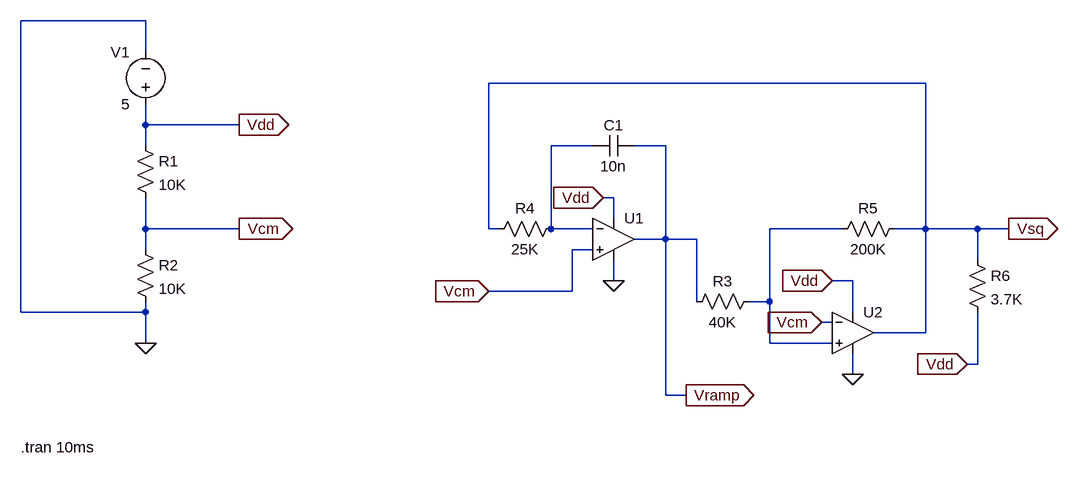
[diagram p0: schematic RAMP GENERATOR.asc]
RAMP GENERATOR.asc, the LTspice schematic file:
Version 4.1
SHEET 1 884 680
WIRE -544 -128 -736 -128
WIRE -544 -80 -544 -128
WIRE 656 -32 -16 -32
WIRE -544 32 -544 0
WIRE -400 32 -544 32
WIRE -544 64 -544 32
WIRE 144 64 80 64
WIRE 256 64 208 64
WIRE 176 144 160 144
WIRE 176 176 176 144
WIRE -544 192 -544 144
WIRE -400 192 -544 192
WIRE -16 192 -16 -32
WIRE 0 192 -16 192
WIRE 80 192 80 64
WIRE 144 192 80 192
WIRE 528 192 416 192
WIRE 656 192 656 -32
WIRE 656 192 608 192
WIRE 736 192 656 192
WIRE 784 192 736 192
WIRE 256 208 256 64
WIRE 256 208 208 208
WIRE 304 208 256 208
WIRE -544 224 -544 192
WIRE 144 224 112 224
WIRE 736 240 736 192
WIRE 176 272 176 240
WIRE 544 272 512 272
WIRE 112 288 112 224
WIRE 112 288 -16 288
WIRE 304 304 304 208
WIRE 416 304 416 192
WIRE 416 304 384 304
WIRE -736 320 -736 -128
WIRE -544 320 -544 304
WIRE -544 320 -736 320
WIRE 544 320 544 272
WIRE 512 336 496 336
WIRE 656 352 656 192
WIRE 656 352 576 352
WIRE -544 368 -544 320
WIRE 416 368 416 304
WIRE 512 368 416 368
WIRE 736 400 736 320
WIRE 736 400 720 400
WIRE 544 416 544 384
WIRE 256 448 256 208
WIRE 288 448 256 448
FLAG -544 368 0
FLAG -400 192 Vcm
IOPIN -400 192 Out
FLAG -400 32 Vdd
IOPIN -400 32 Out
FLAG -16 288 Vcm
IOPIN -16 288 In
FLAG 160 144 Vdd
IOPIN 160 144 In
FLAG 512 272 Vdd
IOPIN 512 272 In
FLAG 176 272 0
FLAG 544 416 0
FLAG 496 336 Vcm
IOPIN 496 336 In
FLAG 288 448 Vramp
IOPIN 288 448 Out
FLAG 784 192 Vsq
IOPIN 784 192 Out
FLAG 720 400 Vdd
IOPIN 720 400 In
SYMBOL res -560 48 R0
SYMATTR InstName R1
SYMATTR Value 10K
SYMBOL res -560 208 R0
SYMATTR InstName R2
SYMATTR Value 10K
SYMBOL OpAmps\\UniversalOpAmp1 176 208 R0
SYMATTR InstName U1
SYMBOL res 96 176 R90
WINDOW 0 0 56 VBottom 2
WINDOW 3 32 56 VTop 2
SYMATTR InstName R4
SYMATTR Value 25K
SYMBOL voltage -544 16 R180
WINDOW 0 24 96 Left 2
WINDOW 3 24 16 Left 2
WINDOW 123 0 0 Left 0
WINDOW 39 0 0 Left 0
SYMATTR InstName V1
SYMATTR Value 5
SYMBOL OpAmps\\UniversalOpAmp2 544 352 R0
SYMATTR InstName U2
SYMBOL res 400 288 R90
WINDOW 0 0 56 VBottom 2
WINDOW 3 32 56 VTop 2
SYMATTR InstName R3
SYMATTR Value 40K
SYMBOL res 624 176 R90
WINDOW 0 0 56 VBottom 2
WINDOW 3 32 56 VTop 2
SYMATTR InstName R5
SYMATTR Value 200K
SYMBOL cap 208 48 R90
WINDOW 0 0 32 VBottom 2
WINDOW 3 32 32 VTop 2
SYMATTR InstName C1
SYMATTR Value 10n
SYMBOL res 720 224 R0
SYMATTR InstName R6
SYMATTR Value 3.7K
TEXT -736 528 Left 2 !.tran 10ms

The netlist it stands for:
* RAMP GENERATOR.asc
R1 Vdd Vcm 10K
R2 Vcm 0 10K
X§U1 Vcm N001 Vdd 0 Vramp level1 Avol=1Meg GBW=10Meg Vos=0 En=0 Enk=0 In=0 Ink=0 Rin=500Meg  ; pins In+ In- V+ V- OUT
R4 N001 Vsq 25K
V1 Vdd 0 5
X§U2 N002 Vcm Vdd 0 Vsq level2 Avol=1Meg GBW=10Meg Slew=10Meg Ilimit=25m Rail=0 Vos=0 En=0 Enk=0 In=0 Ink=0 Rin=500Meg  ; pins In+ In- V+ V- OUT
R3 N002 Vramp 40K
R5 Vsq N002 200K
C1 Vramp N001 10n
R6 Vsq Vdd 3.7K
.tran 10ms
.lib UniversalOpAmp1.lib
.lib UniversalOpAmp2.lib
.backanno
.end